# EAGLE design V3 (EAGLE 9.6.2)
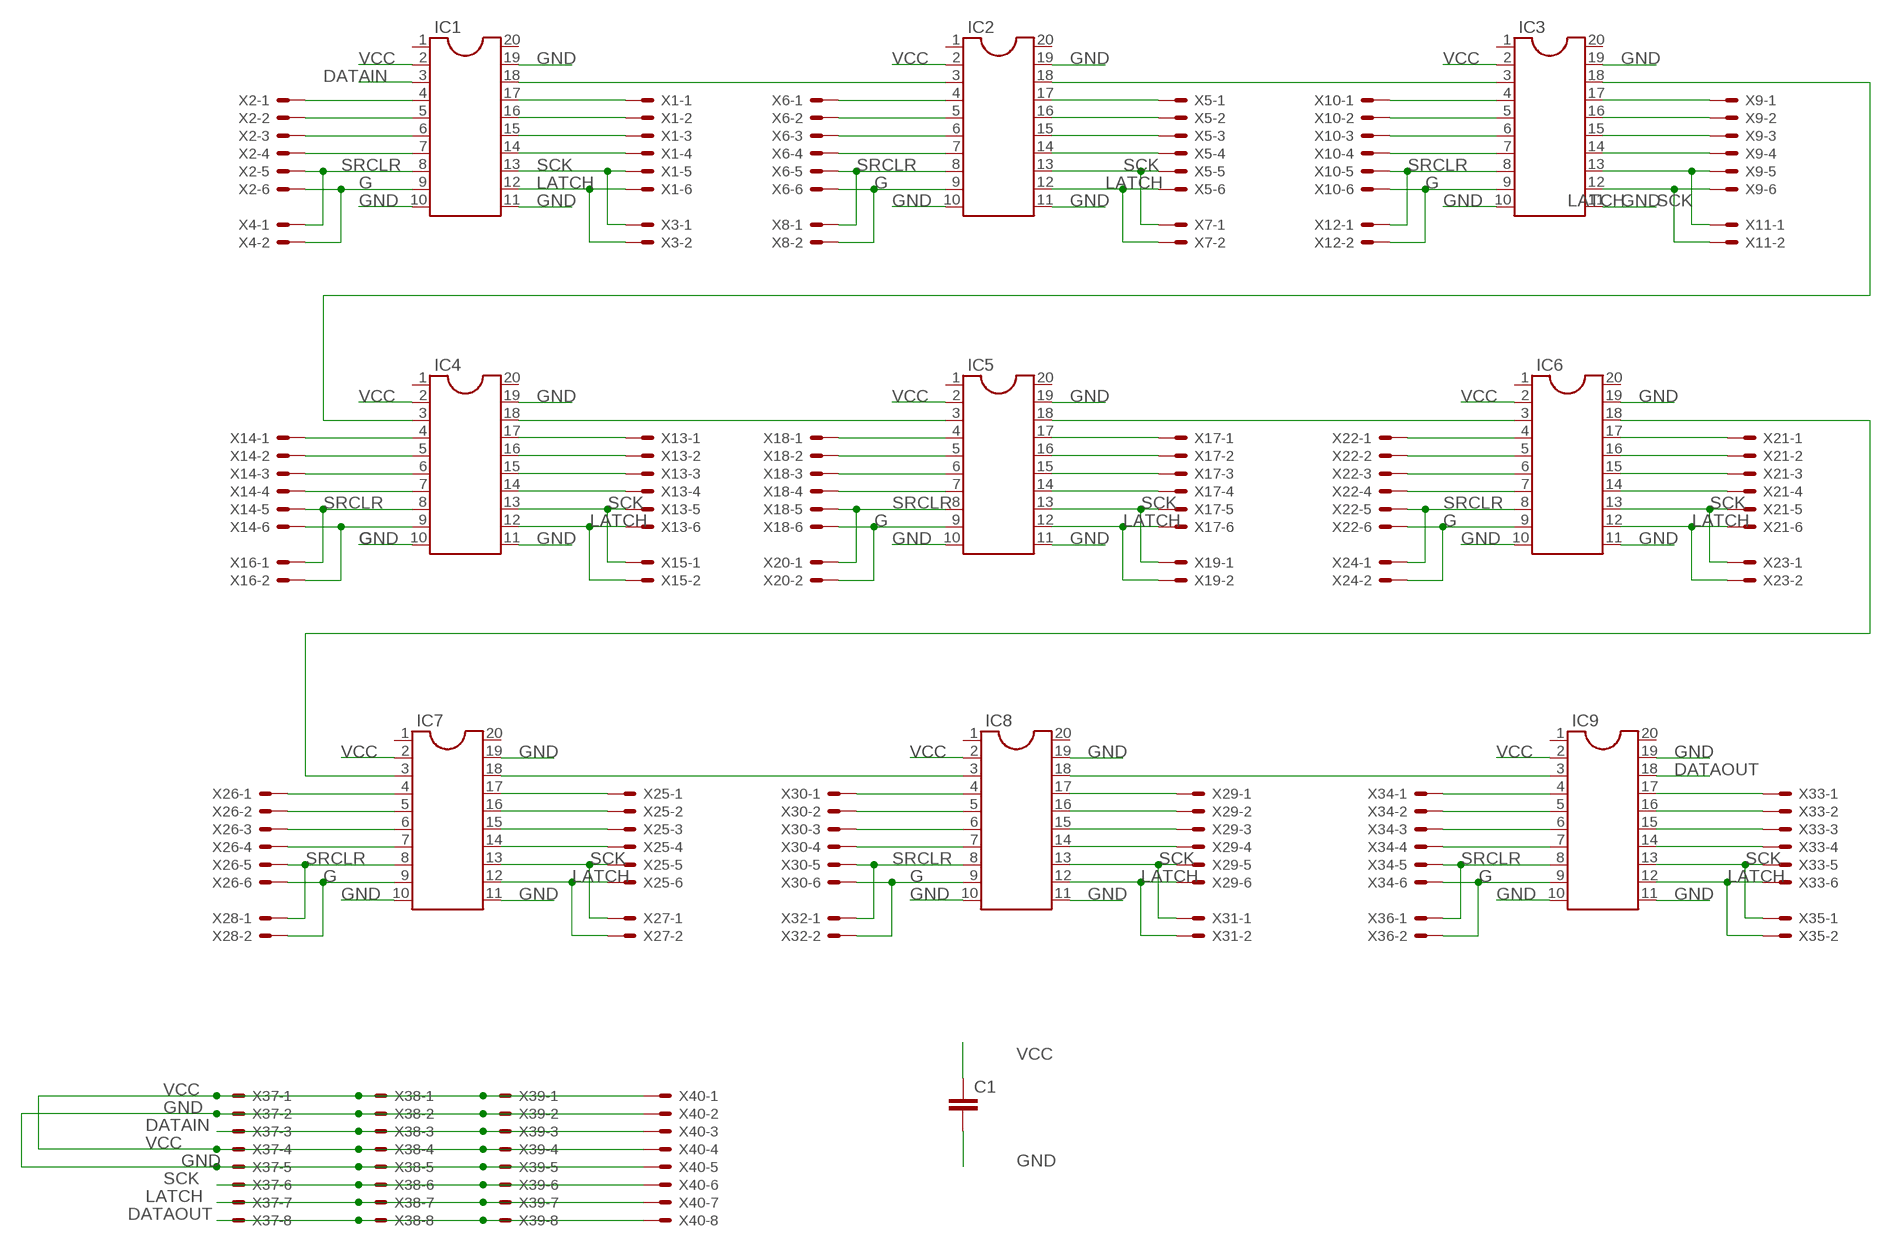
[diagram p0: schematic, sheet 1]

## Parts
C1  C2.5/2  [C2.5-2]
IC1  DIL20  [DIL20]
IC2  DIL20  [DIL20]
IC3  DIL20  [DIL20]
IC4  DIL20  [DIL20]
IC5  DIL20  [DIL20]
IC6  DIL20  [DIL20]
IC7  DIL20  [DIL20]
IC8  DIL20  [DIL20]
IC9  DIL20  [DIL20]
X1  22-23-2061  [22-23-2061]
X2  22-23-2061  [22-23-2061]
X3  22-23-2021  [22-23-2021]
X4  22-23-2021  [22-23-2021]
X5  22-23-2061  [22-23-2061]
X6  22-23-2061  [22-23-2061]
X7  22-23-2021  [22-23-2021]
X8  22-23-2021  [22-23-2021]
X9  22-23-2061  [22-23-2061]
X10  22-23-2061  [22-23-2061]
X11  22-23-2021  [22-23-2021]
X12  22-23-2021  [22-23-2021]
X13  22-23-2061  [22-23-2061]
X14  22-23-2061  [22-23-2061]
X15  22-23-2021  [22-23-2021]
X16  22-23-2021  [22-23-2021]
X17  22-23-2061  [22-23-2061]
X18  22-23-2061  [22-23-2061]
X19  22-23-2021  [22-23-2021]
X20  22-23-2021  [22-23-2021]
X21  22-23-2061  [22-23-2061]
X22  22-23-2061  [22-23-2061]
X23  22-23-2021  [22-23-2021]
X24  22-23-2021  [22-23-2021]
X25  22-23-2061  [22-23-2061]
X26  22-23-2061  [22-23-2061]
X27  22-23-2021  [22-23-2021]
X28  22-23-2021  [22-23-2021]
X29  22-23-2061  [22-23-2061]
X30  22-23-2061  [22-23-2061]
X31  22-23-2021  [22-23-2021]
X32  22-23-2021  [22-23-2021]
X33  22-23-2061  [22-23-2061]
X34  22-23-2061  [22-23-2061]
X35  22-23-2021  [22-23-2021]
X36  22-23-2021  [22-23-2021]
X37  22-23-2081  [22-23-2081]
X38  22-23-2081  [22-23-2081]
X39  22-23-2081  [22-23-2081]
X40  22-23-2081  [22-23-2081]

## Nets
DATAIN: IC1.3 X37.3 X38.3 X39.3 X40.3
DATAOUT: IC9.18 X37.8 X38.8 X39.8 X40.8
G: IC1.9 IC2.9 IC3.9 IC4.9 IC5.9 IC6.9 IC7.9 IC8.9 IC9.9 X2.6 X4.2 X6.6 X8.2 X10.6 X12.2 X14.6 X16.2 X18.6 X20.2 X22.6 X24.2 X26.6 X28.2 X30.6 X32.2 X34.6 X36.2
GND: C1.2 IC1.10 IC1.11 IC1.19 IC2.10 IC2.11 IC2.19 IC3.10 IC3.11 IC3.19 IC4.10 IC4.11 IC4.19 IC5.10 IC5.11 IC5.19 IC6.10 IC6.11 IC6.19 IC7.10 IC7.11 IC7.19 IC8.10 IC8.11 IC8.19 IC9.10 IC9.11 IC9.19 X37.2 X37.5 X38.2 X38.5 X39.2 X39.5 X40.2 X40.5
LATCH: IC1.12 IC2.12 IC3.12 IC4.12 IC5.12 IC6.12 IC7.12 IC8.12 IC9.12 X1.6 X3.2 X5.6 X7.2 X9.6 X11.2 X13.6 X15.2 X17.6 X19.2 X21.6 X23.2 X25.6 X27.2 X29.6 X31.2 X33.6 X35.2 X37.7 X38.7 X39.7 X40.7
N$1: IC1.17 X1.1
N$2: IC1.16 X1.2
N$3: IC1.15 X1.3
N$4: IC1.14 X1.4
N$7: IC1.4 X2.1
N$8: IC1.5 X2.2
N$9: IC1.6 X2.3
N$10: IC1.7 X2.4
N$13: IC2.17 X5.1
N$14: IC2.16 X5.2
N$15: IC2.15 X5.3
N$16: IC2.14 X5.4
N$19: IC2.4 X6.1
N$20: IC2.5 X6.2
N$21: IC2.6 X6.3
N$22: IC2.7 X6.4
N$25: IC3.17 X9.1
N$26: IC3.16 X9.2
N$27: IC3.15 X9.3
N$28: IC3.14 X9.4
N$31: IC3.4 X10.1
N$32: IC3.5 X10.2
N$33: IC3.6 X10.3
N$34: IC3.7 X10.4
N$37: IC4.17 X13.1
N$38: IC4.16 X13.2
N$39: IC4.15 X13.3
N$40: IC4.14 X13.4
N$43: IC4.4 X14.1
N$44: IC4.5 X14.2
N$45: IC4.6 X14.3
N$46: IC4.7 X14.4
N$49: IC5.17 X17.1
N$50: IC5.16 X17.2
N$51: IC5.15 X17.3
N$52: IC5.14 X17.4
N$55: IC5.4 X18.1
N$56: IC5.5 X18.2
N$57: IC5.6 X18.3
N$58: IC5.7 X18.4
N$61: IC6.17 X21.1
N$62: IC6.16 X21.2
N$63: IC6.15 X21.3
N$64: IC6.14 X21.4
N$67: IC6.4 X22.1
N$68: IC6.5 X22.2
N$69: IC6.6 X22.3
N$70: IC6.7 X22.4
N$73: IC7.17 X25.1
N$74: IC7.16 X25.2
N$75: IC7.15 X25.3
N$76: IC7.14 X25.4
N$79: IC7.4 X26.1
N$80: IC7.5 X26.2
N$81: IC7.6 X26.3
N$82: IC7.7 X26.4
N$85: IC8.17 X29.1
N$86: IC8.16 X29.2
N$87: IC8.15 X29.3
N$88: IC8.14 X29.4
N$91: IC8.4 X30.1
N$92: IC8.5 X30.2
N$93: IC8.6 X30.3
N$94: IC8.7 X30.4
N$97: IC9.17 X33.1
N$98: IC9.16 X33.2
N$99: IC9.15 X33.3
N$100: IC9.14 X33.4
N$103: IC9.4 X34.1
N$104: IC9.5 X34.2
N$105: IC9.6 X34.3
N$106: IC9.7 X34.4
N$109: IC1.18 IC2.3
N$110: IC2.18 IC3.3
N$111: IC3.18 IC4.3
N$112: IC4.18 IC5.3
N$113: IC5.18 IC6.3
N$114: IC6.18 IC7.3
N$115: IC7.18 IC8.3
N$116: IC8.18 IC9.3
SCK: IC1.13 IC2.13 IC3.13 IC4.13 IC5.13 IC6.13 IC7.13 IC8.13 IC9.13 X1.5 X3.1 X5.5 X7.1 X9.5 X11.1 X13.5 X15.1 X17.5 X19.1 X21.5 X23.1 X25.5 X27.1 X29.5 X31.1 X33.5 X35.1 X37.6 X38.6 X39.6 X40.6
SRCLR: IC1.8 IC2.8 IC3.8 IC4.8 IC5.8 IC6.8 IC7.8 IC8.8 IC9.8 X2.5 X4.1 X6.5 X8.1 X10.5 X12.1 X14.5 X16.1 X18.5 X20.1 X22.5 X24.1 X26.5 X28.1 X30.5 X32.1 X34.5 X36.1
VCC: C1.1 IC1.2 IC2.2 IC3.2 IC4.2 IC5.2 IC6.2 IC7.2 IC8.2 IC9.2 X37.1 X37.4 X38.1 X38.4 X39.1 X39.4 X40.1 X40.4
Unconnected: IC1.1 IC1.20 IC2.1 IC2.20 IC3.1 IC3.20 IC4.1 IC4.20 IC5.1 IC5.20 IC6.1 IC6.20 IC7.1 IC7.20 IC8.1 IC8.20 IC9.1 IC9.20

## Library data of the parts
C1 = capacitor-wima:C: CAPACITOR naming: grid - package width
IC1-IC9 = ic-package:DIL20: Dual In Line / Socket
X1 X2 X5 X6 X9 X10 X13 X14 X17 X18 X21 X22 X25 X26 X29 X30 X33 X34 = con-molex:22-23-2061: .100" (2.54mm) Center Header - 6 Pin; MF: MOLEX; MPN: 22-23-2061; OC_FARNELL: 1462922; OC_NEWARK: 27C1933
X3 X4 X7 X8 X11 X12 X15 X16 X19 X20 X23 X24 X27 X28 X31 X32 X35 X36 = con-molex:22-23-2021: .100" (2.54mm) Center Header - 2 Pin; MF: MOLEX; MPN: 22-23-2021; OC_FARNELL: 1462926; OC_NEWARK: 25C3832
X37-X40 = con-molex:22-23-2081: .100" (2.54mm) Center Header - 8 Pin; MF: MOLEX; MPN: 22-23-2081; OC_FARNELL: 1756826; OC_NEWARK: 01C7592

## Board
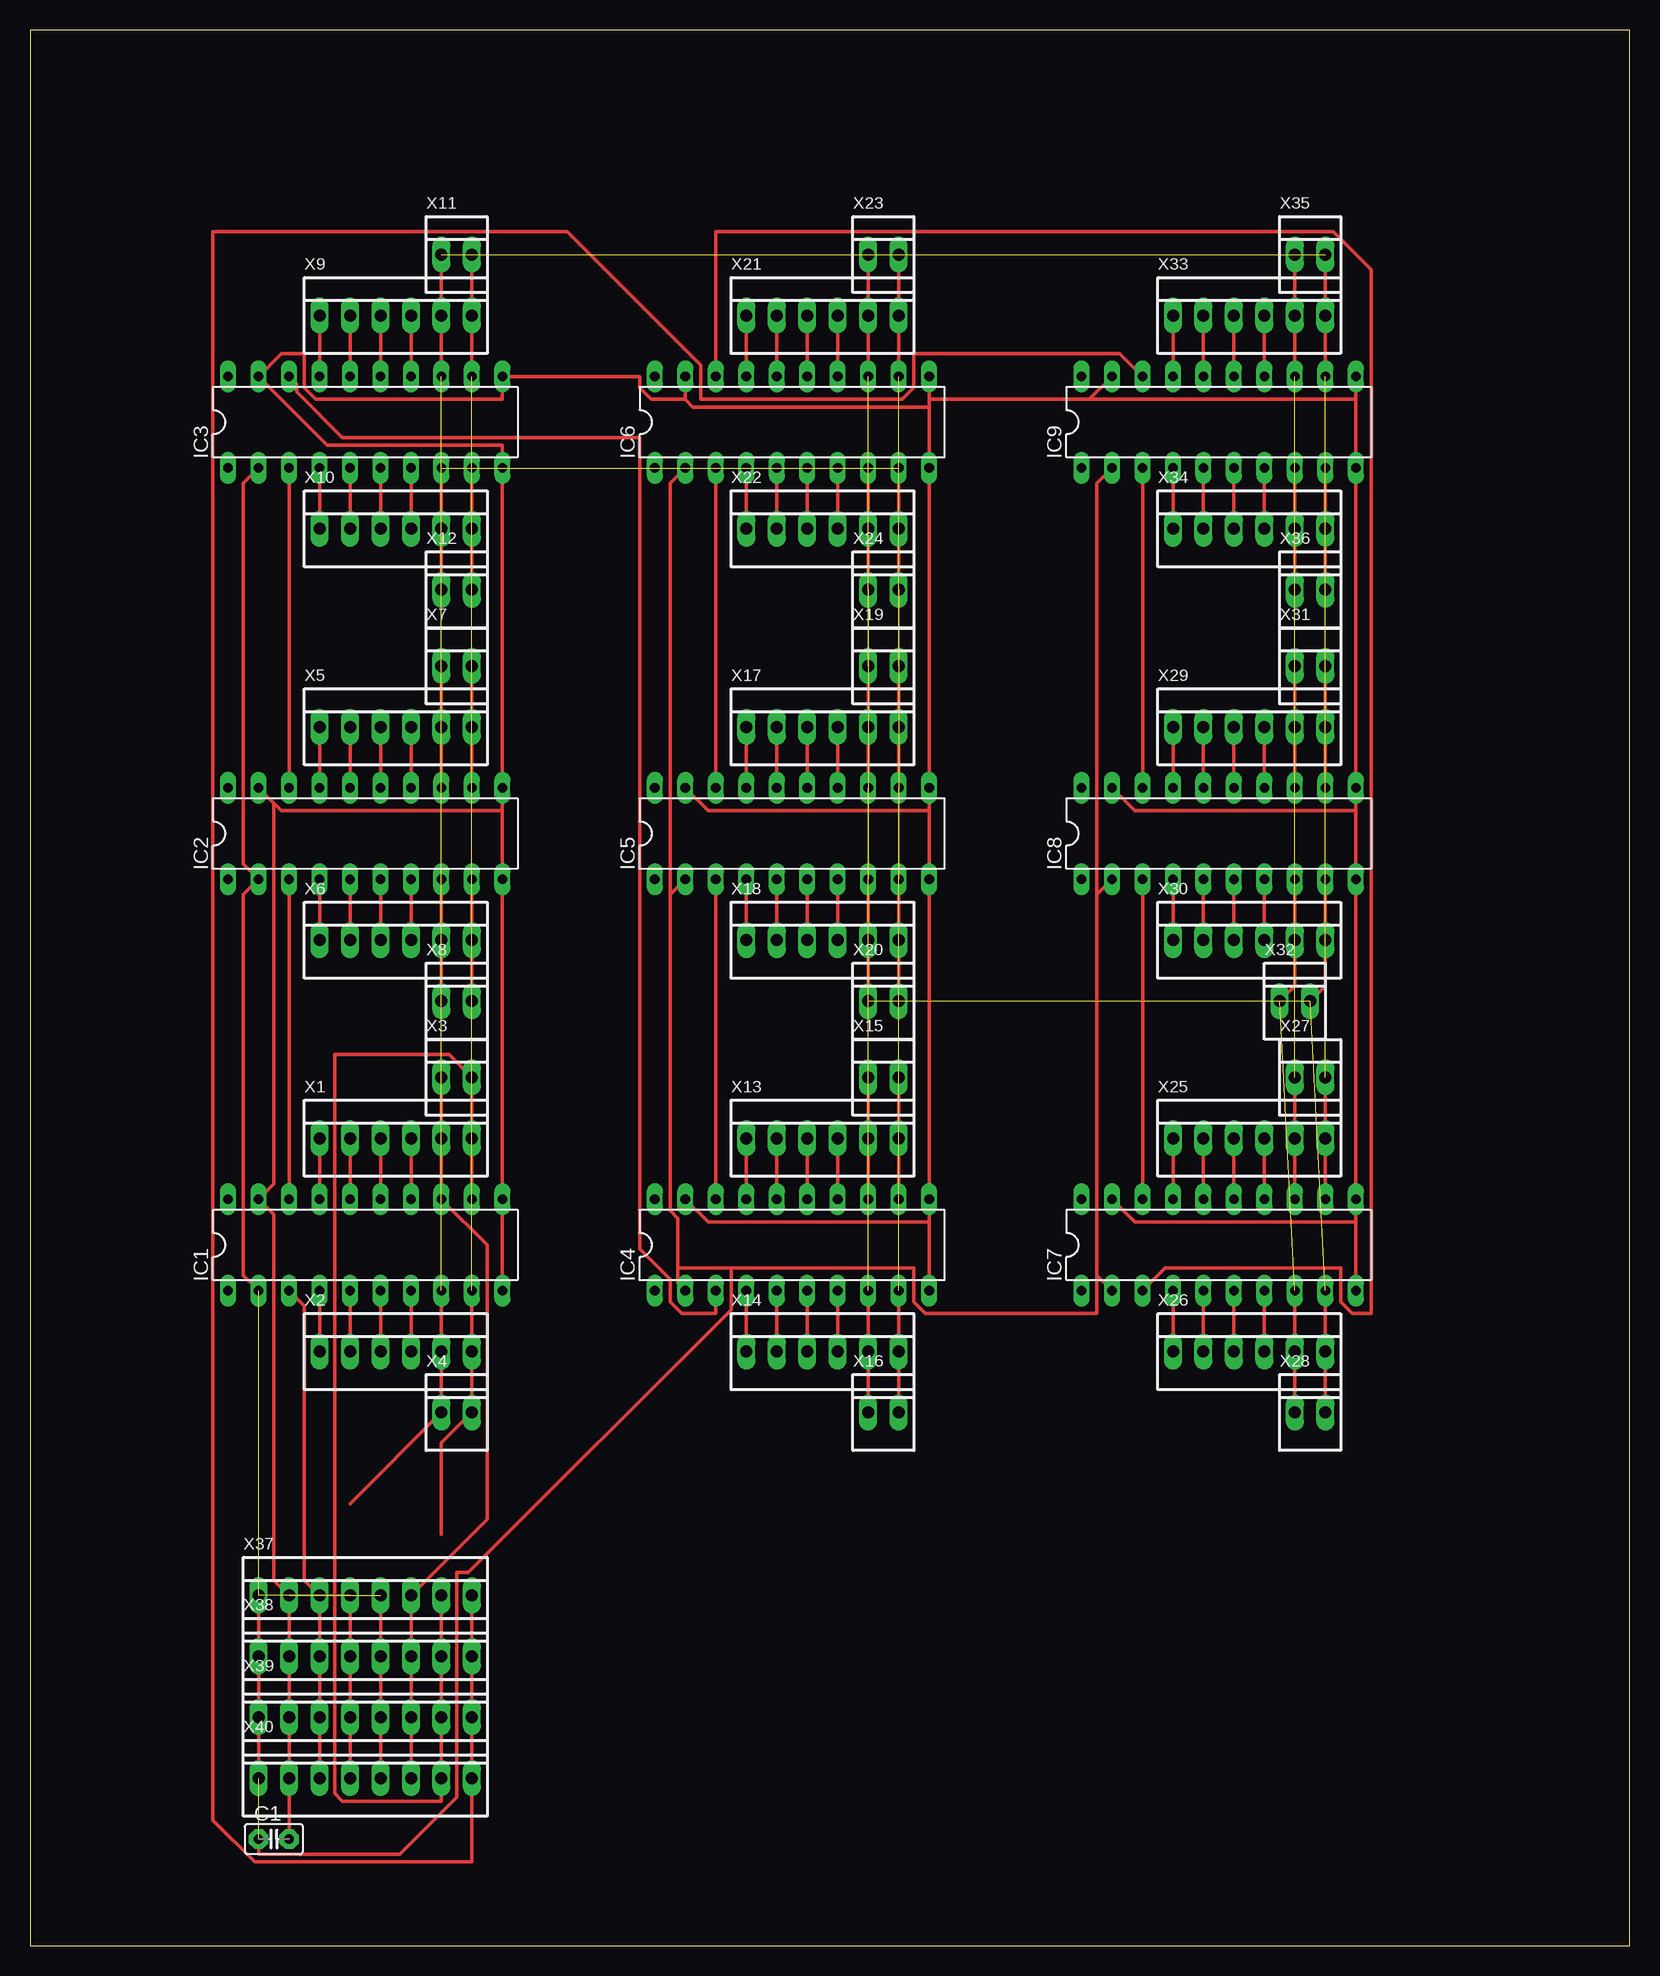
[diagram p1: board, top side]

Size 133.33 x 159.69 mm. Coordinates in mm from the lower left corner, seen from the top.
Outline: 0,0 133.33,0 133.33,159.69 0,159.69 0,0
Copper layers (1*16): Top 0.035mm / dielectric 1.5mm / Bottom 0.035mm
Design rules "default *": minimum track width 12mil, minimum drill 0.35mm, track to track 8mil, track to pad 8mil, pad to pad 8mil, via to via 8mil, smd to smd 8mil, copper to edge 40mil, drill to drill 6mil, minimum pad ring 10mil, minimum via ring 8mil, stop-mask expansion 4mil, vias tented up to drill 0mil, thermal gap 10mil

### Footprints (pad centres in the part's own frame; a part is rotated, then mirrored left to right if it is on the bottom)
C2.5-2 = drill 0.813 pad 1.6 octagon: 1 -1.27,0; 2 1.27,0
DIL20 = drill 0.813 long: 1 -11.43,-3.81; 2 -8.89,-3.81; 3 -6.35,-3.81; 4 -3.81,-3.81; 5 -1.27,-3.81; 6 1.27,-3.81; 7 3.81,-3.81; 8 6.35,-3.81; 9 8.89,-3.81; 10 11.43,-3.81; 11 11.43,3.81; 12 8.89,3.81; 13 6.35,3.81; 14 3.81,3.81; 15 1.27,3.81; 16 -1.27,3.81; 17 -3.81,3.81; 18 -6.35,3.81; 19 -8.89,3.81; 20 -11.43,3.81
22-23-2061 = drill 1 long: 1 -6.35,0; 2 -3.81,0; 3 -1.27,0; 4 1.27,0; 5 3.81,0; 6 6.35,0
22-23-2021 = drill 1 long: 1 -1.27,0; 2 1.27,0
22-23-2081 = drill 1 long: 1 -8.89,0; 2 -6.35,0; 3 -3.81,0; 4 -1.27,0; 5 1.27,0; 6 3.81,0; 7 6.35,0; 8 8.89,0

### Placement (x,y rotation side)
C1  20.32,8.89 0 top
IC1  27.94,58.42 0 top
IC2  27.94,92.71 0 top
IC3  27.94,127 0 top
IC4  63.5,58.42 0 top
IC5  63.5,92.71 0 top
IC6  63.5,127 0 top
IC7  99.06,58.42 0 top
IC8  99.06,92.71 0 top
IC9  99.06,127 0 top
X1  30.48,67.31 0 top
X2  30.48,49.53 0 top
X3  35.56,72.39 0 top
X4  35.56,44.45 0 top
X5  30.48,101.6 0 top
X6  30.48,83.82 0 top
X7  35.56,106.68 0 top
X8  35.56,78.74 0 top
X9  30.48,135.89 0 top
X10  30.48,118.11 0 top
X11  35.56,140.97 0 top
X12  35.56,113.03 0 top
X13  66.04,67.31 0 top
X14  66.04,49.53 0 top
X15  71.12,72.39 0 top
X16  71.12,44.45 0 top
X17  66.04,101.6 0 top
X18  66.04,83.82 0 top
X19  71.12,106.68 0 top
X20  71.12,78.74 0 top
X21  66.04,135.89 0 top
X22  66.04,118.11 0 top
X23  71.12,140.97 0 top
X24  71.12,113.03 0 top
X25  101.6,67.31 0 top
X26  101.6,49.53 0 top
X27  106.68,72.39 0 top
X28  106.68,44.45 0 top
X29  101.6,101.6 0 top
X30  101.6,83.82 0 top
X31  106.68,106.68 0 top
X32  105.41,78.74 0 top
X33  101.6,135.89 0 top
X34  101.6,118.11 0 top
X35  106.68,140.97 0 top
X36  106.68,113.03 0 top
X37  27.94,29.21 0 top
X38  27.94,24.13 0 top
X39  27.94,19.05 0 top
X40  27.94,13.97 0 top

### Tracks (layer width: path | path; a pad name or v marks a point on that pad's centre or on a via)
DATAIN
  Top 0.305: X40.3 X39.3 X38.3 X37.3 22.86,30.48 22.86,53.34 IC1.3
DATAOUT
  Top 0.305: X37.8 X38.8 X39.8 X40.8 36.83,6.99 18.73,6.99 15.24,10.48 15.24,142.88 44.77,142.88 55.88,131.76 55.88,128.91 72.71,128.91 73.66,129.86 73.66,132.72 90.81,132.72 IC9.18
G  (8 unrouted)
  Top 0.305: IC1.9 X2.6 X4.2 34.29,41.91 34.29,34.29 | IC2.9 X6.6 X8.2 | IC3.9 X10.6 X12.2 | IC4.9 X14.6 X16.2 | IC5.9 X18.6 X20.2 | IC6.9 X22.6 X24.2 | IC7.9 X26.6 X28.2 | IC8.9 X30.6 107.95,80.01 X32.2 | IC9.9 X34.6 X36.2
GND  (1 unrouted)
  Top 0.305: C1.2 X40.2 X39.2 X38.2 X37.2 20.32,30.48 20.32,60.96 IC1.19 20.32,63.5 20.32,95.25 | IC1.10 IC1.11 IC2.10 39.37,94.61 | 39.37,94.61 IC2.11 IC3.10 39.37,125.09 24.77,125.09 IC3.19 20.95,132.72 22.86,132.72 22.86,129.86 23.81,128.91 39.37,128.91 IC3.11 50.8,130.81 50.8,129.86 51.75,128.91 54.61,128.91 | 20.32,95.25 20.95,94.61 39.37,94.61 | 20.32,95.25 IC2.19 | IC7.19 92.08,60.33 110.49,60.33 | 110.49,60.33 IC7.11 IC8.10 110.49,94.61 | 110.49,60.33 IC7.10 | IC8.19 92.08,94.61 110.49,94.61 | 110.49,94.61 IC8.11 IC9.10 110.49,128.91 | 74.93,60.33 IC4.11 IC5.10 74.93,94.61 | 74.93,60.33 IC4.10 | IC4.19 56.52,60.33 74.93,60.33 | 74.93,94.61 IC5.11 IC6.10 74.93,128.27 | IC5.19 56.52,94.61 74.93,94.61 | IC6.19 54.61,128.91 | IC9.11 110.49,128.91 | IC6.11 74.93,128.91 | 74.93,128.91 74.93,128.27 | 88.27,128.91 IC9.19 | 74.93,128.91 88.27,128.91 | 88.27,128.91 110.49,128.91 | 54.61,128.91 55.24,128.27 74.93,128.27 | X40.5 X39.5 X38.5 X37.5
LATCH  (8 unrouted)
  Top 0.305: IC1.12 X1.6 X3.2 34.92,74.3 25.4,74.3 25.4,12.7 26.04,12.06 34.29,12.06 X40.7 X39.7 X38.7 X37.7 | IC2.12 X5.6 X7.2 | IC3.12 X9.6 X11.2 | IC4.12 X13.6 X15.2 | IC5.12 X17.6 X19.2 | IC6.12 X21.6 X23.2 | IC7.12 X25.6 X27.2 | IC8.12 X29.6 X31.2 | IC9.12 X33.6 X35.2
N$1
  Top 0.305: X1.1 IC1.17
N$2
  Top 0.305: X1.2 IC1.16
N$3
  Top 0.305: X1.3 IC1.15
N$4
  Top 0.305: X1.4 IC1.14
N$7
  Top 0.305: X2.1 IC1.4
N$8
  Top 0.305: X2.2 IC1.5
N$9
  Top 0.305: X2.3 IC1.6
N$10
  Top 0.305: X2.4 IC1.7
N$13
  Top 0.305: X5.1 IC2.17
N$14
  Top 0.305: X5.2 IC2.16
N$15
  Top 0.305: X5.3 IC2.15
N$16
  Top 0.305: X5.4 IC2.14
N$19
  Top 0.305: X6.1 IC2.4
N$20
  Top 0.305: X6.2 IC2.5
N$21
  Top 0.305: X6.3 IC2.6
N$22
  Top 0.305: X6.4 IC2.7
N$25
  Top 0.305: X9.1 IC3.17
N$26
  Top 0.305: X9.2 IC3.16
N$27
  Top 0.305: X9.3 IC3.15
N$28
  Top 0.305: X9.4 IC3.14
N$31
  Top 0.305: X10.1 IC3.4
N$32
  Top 0.305: X10.2 IC3.5
N$33
  Top 0.305: X10.3 IC3.6
N$34
  Top 0.305: X10.4 IC3.7
N$37
  Top 0.305: X13.1 IC4.17
N$38
  Top 0.305: X13.2 IC4.16
N$39
  Top 0.305: X13.3 IC4.15
N$40
  Top 0.305: X13.4 IC4.14
N$43
  Top 0.305: X14.1 IC4.4
N$44
  Top 0.305: X14.2 IC4.5
N$45
  Top 0.305: X14.3 IC4.6
N$46
  Top 0.305: X14.4 IC4.7
N$49
  Top 0.305: X17.1 IC5.17
N$50
  Top 0.305: X17.2 IC5.16
N$51
  Top 0.305: X17.3 IC5.15
N$52
  Top 0.305: X17.4 IC5.14
N$55
  Top 0.305: X18.1 IC5.4
N$56
  Top 0.305: X18.2 IC5.5
N$57
  Top 0.305: X18.3 IC5.6
N$58
  Top 0.305: X18.4 IC5.7
N$61
  Top 0.305: X21.1 IC6.17
N$62
  Top 0.305: X21.2 IC6.16
N$63
  Top 0.305: X21.3 IC6.15
N$64
  Top 0.305: X21.4 IC6.14
N$67
  Top 0.305: X22.1 IC6.4
N$68
  Top 0.305: X22.2 IC6.5
N$69
  Top 0.305: X22.3 IC6.6
N$70
  Top 0.305: X22.4 IC6.7
N$73
  Top 0.305: X25.1 IC7.17
N$74
  Top 0.305: X25.2 IC7.16
N$75
  Top 0.305: X25.3 IC7.15
N$76
  Top 0.305: X25.4 IC7.14
N$79
  Top 0.305: X26.1 IC7.4
N$80
  Top 0.305: X26.2 IC7.5
N$81
  Top 0.305: X26.3 IC7.6
N$82
  Top 0.305: X26.4 IC7.7
N$85
  Top 0.305: X29.1 IC8.17
N$86
  Top 0.305: X29.2 IC8.16
N$87
  Top 0.305: X29.3 IC8.15
N$88
  Top 0.305: X29.4 IC8.14
N$91
  Top 0.305: X30.1 IC8.4
N$92
  Top 0.305: X30.2 IC8.5
N$93
  Top 0.305: X30.3 IC8.6
N$94
  Top 0.305: X30.4 IC8.7
N$97
  Top 0.305: X33.1 IC9.17
N$98
  Top 0.305: X33.2 IC9.16
N$99
  Top 0.305: X33.3 IC9.15
N$100
  Top 0.305: X33.4 IC9.14
N$103
  Top 0.305: X34.1 IC9.4
N$104
  Top 0.305: X34.2 IC9.5
N$105
  Top 0.305: X34.3 IC9.6
N$106
  Top 0.305: X34.4 IC9.7
N$109
  Top 0.305: IC2.3 IC1.18
N$110
  Top 0.305: IC3.3 IC2.18
N$111
  Top 0.305: IC3.18 22.23,130.18 22.23,129.54 26.04,125.73 50.8,125.73 50.8,58.1 53.34,55.56 53.34,53.66 54.29,52.7 57.15,52.7 IC4.3
N$112
  Top 0.305: IC5.3 IC4.18
N$113
  Top 0.305: IC6.3 IC5.18
N$114
  Top 0.305: IC7.3 94.61,56.52 109.22,56.52 109.22,53.66 110.17,52.7 111.76,52.7 111.76,139.7 108.58,142.88 57.15,142.88 IC6.18
N$115
  Top 0.305: IC8.3 IC7.18
N$116
  Top 0.305: IC9.3 IC8.18
SCK  (8 unrouted)
  Top 0.305: X3.1 X1.5 IC1.13 38.1,58.42 38.1,35.56 X37.6 X38.6 X39.6 X40.6 | IC2.13 X5.5 X7.1 | IC3.13 X9.5 X11.1 | IC4.13 X13.5 X15.1 | IC5.13 X17.5 X19.1 | IC6.13 X21.5 X23.1 | IC7.13 X25.5 X27.1 | IC8.13 X29.5 X31.1 | IC9.13 X33.5 X35.1
SRCLR  (8 unrouted)
  Top 0.305: IC1.8 X2.5 X4.1 26.67,36.83 | IC2.8 X6.5 X8.1 | IC3.8 X10.5 X12.1 | IC4.8 X14.5 X16.1 | IC5.8 X18.5 X20.1 | IC6.8 X22.5 X24.1 | IC7.8 X26.5 X28.1 | IC8.8 X30.5 105.41,80.01 X32.1 | IC9.8 X34.5 X36.1
VCC  (3 unrouted)
  Top 0.305: IC4.2 53.98,55.24 53.98,56.52 | 53.98,56.52 53.98,60.64 53.34,61.28 53.34,87.63 | IC5.2 53.34,87.63 | IC6.2 53.34,121.92 53.34,87.63 | 88.9,55.88 IC7.2 | 88.9,87.63 88.9,55.88 | IC8.2 88.9,87.63 | IC9.2 88.9,121.92 88.9,87.63 | 58.42,56.52 73.66,56.52 73.66,53.66 74.61,52.7 88.9,52.7 88.9,55.88 | 58.42,56.52 53.98,56.52 | IC3.2 17.78,121.92 17.78,90.17 IC2.2 17.78,87.63 17.78,55.88 IC1.2 | 58.42,56.52 58.42,53.02 36.51,31.11 35.56,31.11 35.56,12.38 30.8,7.62 19.05,7.62 C1.1 | X40.4 X39.4 X38.4 X37.4 | X40.1 X39.1 X38.1 X37.1